# Altium schematic sheet powerup_button.SchDoc: Powerup button
size A4; SheetNumber: 14; SheetTotal: 20; TitleBig: Powerup button; Desc_line1: This circuit avoids using a power-up switch, which can shutdown the device without prior warning. The user pushes a; Desc_line2: button during a couple of seconds, in which the ESP32 will boot and keep the system on until a shutdown signal is sent.
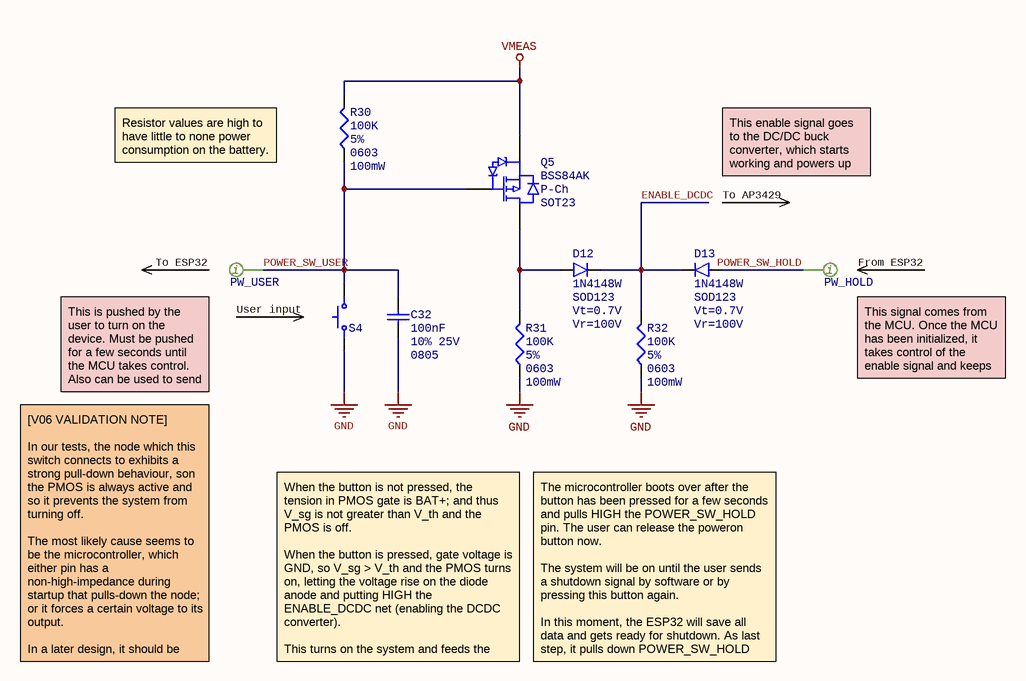
[diagram p0: powerup_button.SchDoc]

## Parts
C32  value 100nF  Tolerance: 10% 25V  PackageDescription: 0805  [CAP 0805_2012]  (hidden comment: Cap_cer_0805)
D12  Part: 1N4148W  PackageDescription: SOD123  ForwardVoltage: Vt=0.7V  ReverseVoltage: Vr=100V  [SOD123F 1N4148W]  (hidden comment: Diode 1N4148W)
D13  Part: 1N4148W  PackageDescription: SOD123  ForwardVoltage: Vt=0.7V  ReverseVoltage: Vr=100V  [SOD123F 1N4148W]  (hidden comment: Diode 1N4148W)
PW_HOLD  Test Point Pad dual sided  [TEST POINT PAD]  (value not drawn)  (no BOM)
PW_USER  Test Point Pad dual sided  [TEST POINT PAD]  (value not drawn)  (no BOM)
Q5  Part: BSS84AK  Type: P-Ch  PackageDescription: SOT23  [SOT-23-3 TO-236AB 2N7002]  (hidden comment: PMOS BSS84AK)
R30  value 100K  Tolerance: 5%  PackageDescription: 0603  PowerDisipated: 100mW  [RES 0603_1608]  (hidden comment: Res_0603_100K_5%_100mW)
R31  value 100K  Tolerance: 5%  PackageDescription: 0603  PowerDisipated: 100mW  [RES 0603_1608]  (hidden comment: Res_0603_100K_5%_100mW)
R32  value 100K  Tolerance: 5%  PackageDescription: 0603  PowerDisipated: 100mW  [RES 0603_1608]  (hidden comment: Res_0603_100K_5%_100mW)
S4  Button  [button generic]  (value not drawn)

## Nets
GND: C32.1 R31.1 R32.1 S4.1
VMEAS: Q5.2(S) R30.2
ENABLE_DCDC: D12.2 D13.2 R32.2
POWER_SW_HOLD: D13.1 PW_HOLD.1
POWER_SW_USER: C32.2 PW_USER.1 Q5.1(G) R30.1 S4.2
NetD12_1: D12.1 Q5.3(D) R31.2

## Notes on the sheet
- Resistor values are high to have little to none power consumption on the battery.
- This enable signal goes to the DC/DC buck converter, which starts working and powers up the system
- To AP3429
- (near PW_USER) To ESP32
- User input
- (near PW_HOLD) From ESP32
- (near PW_USER) This is pushed by the user to turn on the device. Must be pushed for a few seconds until the MCU takes control. Also can be used to send a shutdown signal.
- (near PW_HOLD) This signal comes from the MCU. Once the MCU has been initialized, it takes control of the enable signal and keeps the DC/DC ON.
- [V06 VALIDATION NOTE]
  In our tests, the node which this switch connects to exhibits a strong pull-down behaviour, son the PMOS is always active and so it prevents the system from turning off.
  The most likely cause seems to be the microcontroller, which either pin has a non-high-impedance during startup that pulls-down the node; or it forces a certain voltage to its output.
  In a later design, it should be tested on another pin.
- When the button is not pressed, the tension in PMOS gate is BAT+; and thus V_sg is not greater than V_th and the PMOS is off.
  When the button is pressed, gate voltage is GND, so V_sg > V_th and the PMOS turns on, letting the voltage rise on the diode anode and putting HIGH the ENABLE_DCDC net (enabling the DCDC converter).
  This turns on the system and feeds the ESP32 (continues →)
- The microcontroller boots over after the button has been pressed for a few seconds and pulls HIGH the POWER_SW_HOLD pin. The user can release the poweron button now.
  The system will be on until the user sends a shutdown signal by software or by pressing this button again.
  In this moment, the ESP32 will save all data and gets ready for shutdown. As last step, it pulls down POWER_SW_HOLD and the system powers off completely.
- Designer's signature
- Sheet title:
- Sr. Andrés Roldán Aranda
- Supervisor:
- Supervisor's signature
- Project title:
- Desginer:
- Dpto. Electrónica y Tecnología
- de Computadores
- University of Granada
- C/ Fuente Nueva, s/n, 18001
- Granada, Granada, Spain
- Date:
- Revision:
- Sheet
- of
- (in symbol Test Point Pad dual sided) i

## Library data of the parts
C32 = Cap_cer_0805_100nF_10%: Ceramic cap size 0805; FabGroup: Buttons - Powerup button; FabOrder: 3
D12 D13 = Diode 1N4148W: SURFACE MOUNT FAST SWITCHING DIODE; Type: Rectifier, General purpose; FabGroup: Buttons - Powerup button; FabOrder: 3
PW_HOLD PW_USER = Test Point Pad dual sided: Test point - PCB Pad dual sided
Q5 = PMOS BSS84AK: FabGroup: Buttons - Powerup button; FabOrder: 3; Value: *
R30-R32 = Res_0603_100K_5%_100mW: Res size 0603 SMD mounting, low power
S4 = Button: Generic 2 pin button; FabGroup: Buttons - Powerup button; FabOrder: 3; PackageDescription: SMD 2-pin